# EAGLE design esp_garden (EAGLE 8.0.1)
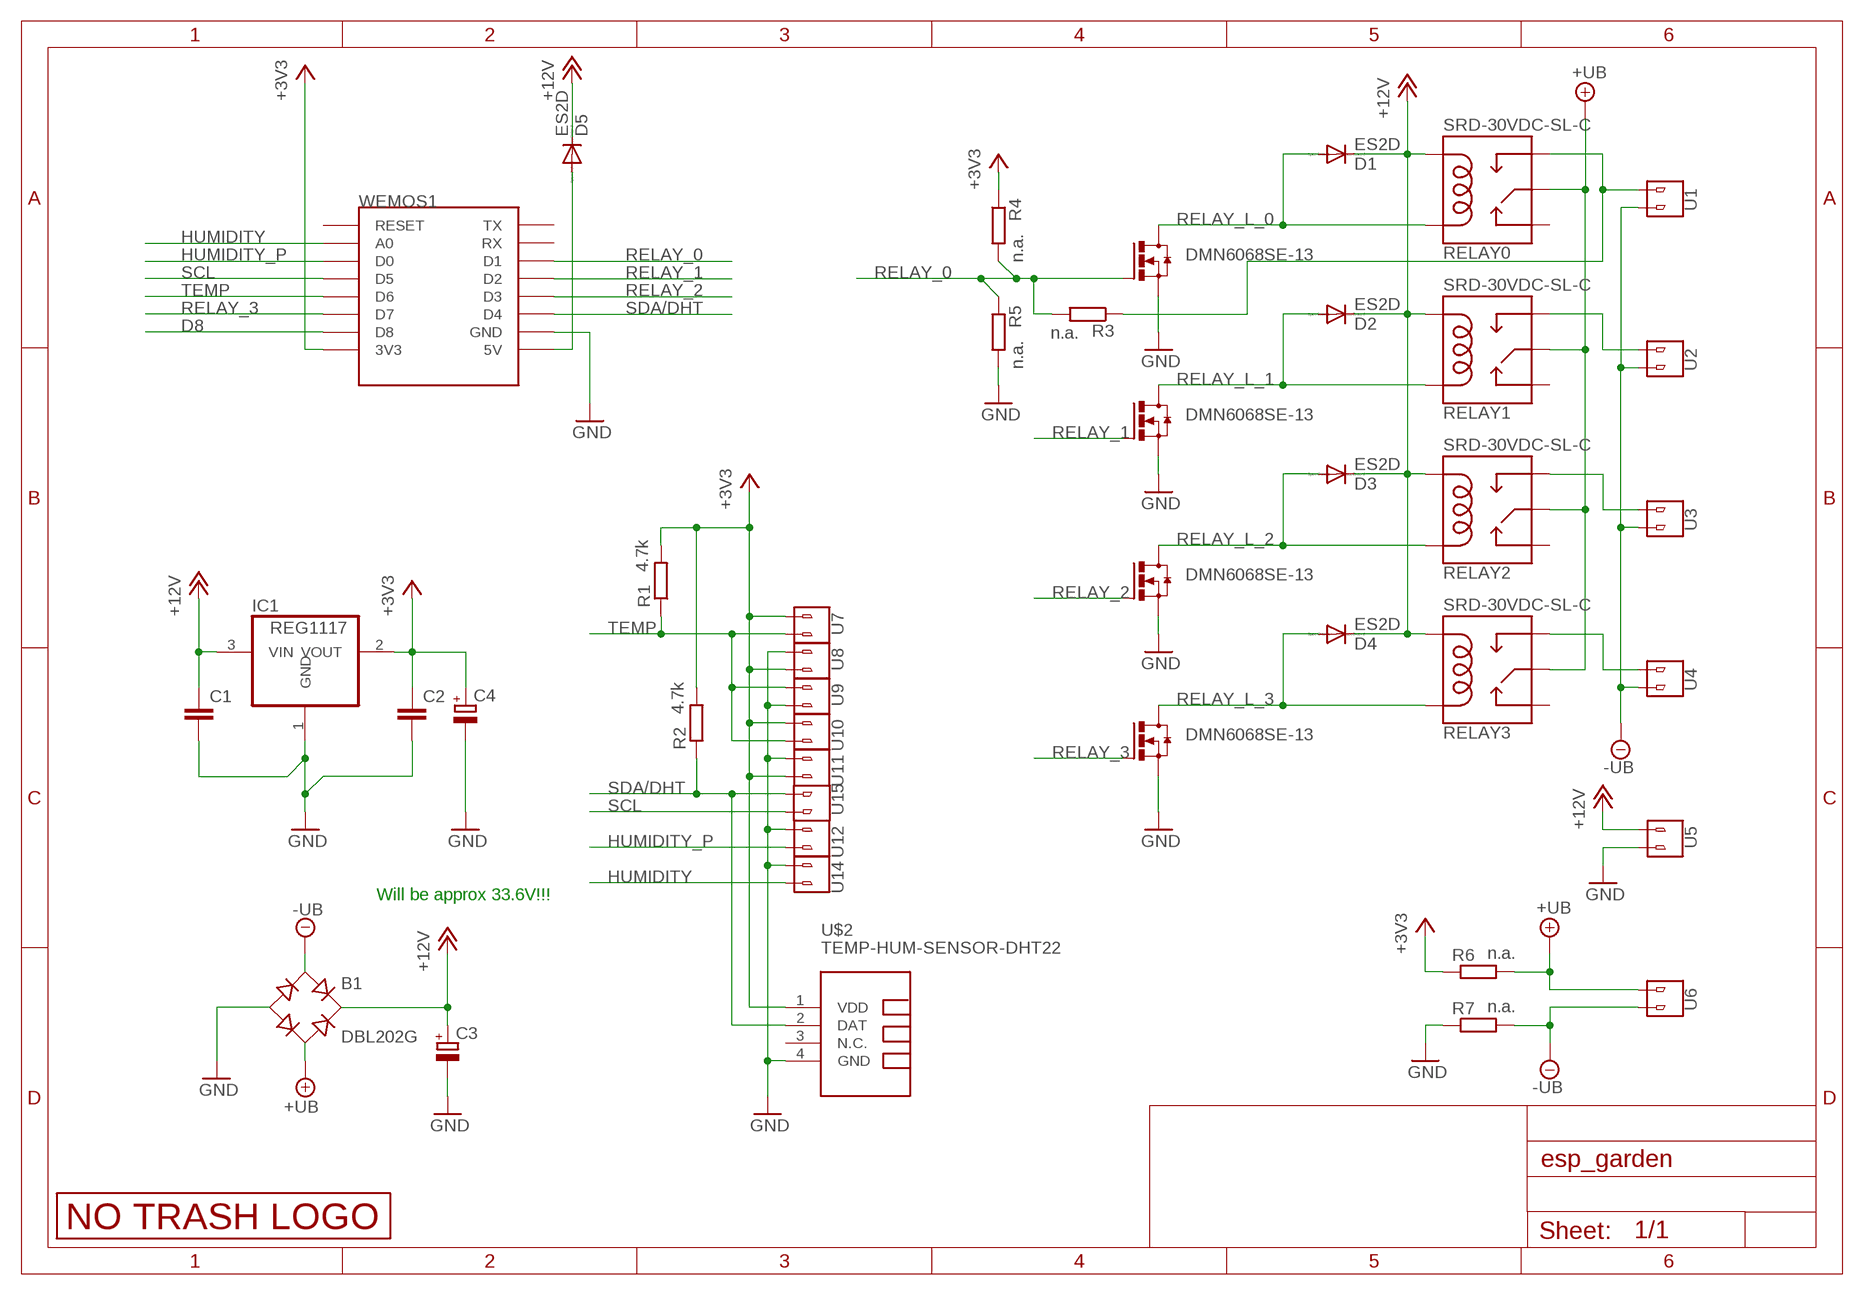
[diagram p0: schematic, sheet 1]

## Parts
B1  DBL202G  [DB]
C1  C-EUC0805  [C0805]
C2  C-EUC0805  [C0805]
C3  CPOL-EU150CLZ-0810  [150CLZ-0810]
C4  CPOL-EU150CLZ-0810  [150CLZ-0810]
D1  ES2D  DIODE-SMB  [SMB]
D2  ES2D  DIODE-SMB  [SMB]
D3  ES2D  DIODE-SMB  [SMB]
D4  ES2D  DIODE-SMB  [SMB]
D5  ES2D  DIODE-SMB  [SMB]
IC1  REG1117  [SOT223]
R1  4.7k  R-EU_M0805  [M0805]
R2  4.7k  R-EU_M0805  [M0805]
R3  n.a.  R-EU_M0805  [M0805]
R4  n.a.  R-EU_M0805  [M0805]
R5  n.a.  R-EU_M0805  [M0805]
R6  n.a.  R-EU_M0805  [M0805]
R7  n.a.  R-EU_M0805  [M0805]
RELAY0  SRD-30VDC-SL-C  RELAYPTH  [SRD-05VDC-SL-C]
RELAY1  SRD-30VDC-SL-C  RELAYPTH  [SRD-05VDC-SL-C]
RELAY2  SRD-30VDC-SL-C  RELAYPTH  [SRD-05VDC-SL-C]
RELAY3  SRD-30VDC-SL-C  RELAYPTH  [SRD-05VDC-SL-C]
T1  DMN6068SE-13  NMOSFET_SMD_223  [SOT223]
T2  DMN6068SE-13  NMOSFET_SMD_223  [SOT223]
T3  DMN6068SE-13  NMOSFET_SMD_223  [SOT223]
T4  DMN6068SE-13  NMOSFET_SMD_223  [SOT223]
U1  V1  2_PIN_CONNECTOR  [2_SCREW_PIN]
U2  V1  2_PIN_CONNECTOR  [2_SCREW_PIN]
U3  V1  2_PIN_CONNECTOR  [2_SCREW_PIN]
U4  V1  2_PIN_CONNECTOR  [2_SCREW_PIN]
U5  V1  2_PIN_CONNECTOR  [2_SCREW_PIN]
U6  V1  2_PIN_CONNECTOR  [2_SCREW_PIN]
U7  V1  2_PIN_CONNECTOR  [2_SCREW_PIN]
U8  V1  2_PIN_CONNECTOR  [2_SCREW_PIN]
U9  V1  2_PIN_CONNECTOR  [2_SCREW_PIN]
U10  V1  2_PIN_CONNECTOR  [2_SCREW_PIN]
U11  V1  2_PIN_CONNECTOR  [2_SCREW_PIN]
U12  V1  2_PIN_CONNECTOR  [2_SCREW_PIN]
U14  V1  2_PIN_CONNECTOR  [2_SCREW_PIN]
U15  V1  2_PIN_CONNECTOR  [2_SCREW_PIN]
U$1  LOGO_NO_TRASHNO_TRASH  [LOGO_ROHS_NO_TRASH]
U$2  TEMP-HUM-SENSOR-DHT22  [TEMP-HUM-SENSOR-DHT22]
WEMOS1  WEMOS-D1-MINI  [WEMOS-D1-MINI]

## Nets
+3V3: C2.1 C4.+ IC1.2(VOUT) R1.2 R2.2 R4.1 R6.1 U7.P$2 U8.P$1 U10.P$2 U11.P$1 U$2.1(VDD) WEMOS1.3V3
+12V: B1.+ C1.1 C3.+ D1.C D2.C D3.C D4.C D5.C IC1.3(VIN) RELAY0.COIL0 RELAY1.COIL0 RELAY2.COIL0 RELAY3.COIL0 U5.P$2
+UB: B1.AC2 R6.2 RELAY0.SWCOMMON RELAY1.SWCOMMON RELAY2.SWCOMMON RELAY3.SWCOMMON U6.P$1
-UB: B1.AC1 R7.2 U1.P$2 U2.P$2 U3.P$2 U4.P$2 U6.P$2
D8: WEMOS1.D8
GND: B1.- C1.2 C2.2 C3.- C4.- IC1.1(GND) R5.2 R7.1 T1.3(S) T2.3(S) T3.3(S) T4.3(S) U5.P$1 U8.P$2 U9.P$1 U11.P$2 U12.P$2 U14.P$2 U$2.4(GND) WEMOS1.GND
HUMIDITY: U14.P$1 WEMOS1.A0
HUMIDITY_P: U12.P$1 WEMOS1.D0
N$1: D5.A WEMOS1.5V
N$4: R3.1 RELAY0.SWOPEN U1.P$1
N$6: RELAY1.SWOPEN U2.P$1
N$7: RELAY2.SWOPEN U3.P$1
N$8: RELAY3.SWOPEN U4.P$1
RELAY_0: R3.2 R4.2 R5.1 T1.1(G) WEMOS1.D1
RELAY_1: T2.1(G) WEMOS1.D2
RELAY_2: T3.1(G) WEMOS1.D3
RELAY_3: T4.1(G) WEMOS1.D7
RELAY_L_0: D1.A RELAY0.COIL1 T1.2(D) T1.4(D)
RELAY_L_1: D2.A RELAY1.COIL1 T2.2(D) T2.4(D)
RELAY_L_2: D3.A RELAY2.COIL1 T3.2(D) T3.4(D)
RELAY_L_3: D4.A RELAY3.COIL1 T4.2(D) T4.4(D)
SCL: U15.P$2 WEMOS1.D5
SDA/DHT: R2.1 U15.P$1 U$2.2(DAT) WEMOS1.D4
TEMP: R1.1 U7.P$1 U9.P$2 U10.P$1 WEMOS1.D6
Unconnected: RELAY0.SWCLOSED(SWCLOSE) RELAY1.SWCLOSED(SWCLOSE) RELAY2.SWCLOSED(SWCLOSE) RELAY3.SWCLOSED(SWCLOSE) U$2.3(N.C.) WEMOS1.RESET WEMOS1.RX WEMOS1.TX

## Notes on the sheet
- Will be approx 33.6V!!!

## Library data of the parts
B1 = rectifier:DB?*G: Single Phase 1.0 AMP Glass Passivated Bridge Rectifier Taiwan Semiconductor Co.,Ltd. - TSC Source: http://www.taiwansemi.com/TSCbig5/ezcatfiles/cust/img/img/db101g.pdf http://www.ts.com.tw/db/pictures/modules/PDT/PDT060207001/DBLS201G.pdf
C1 C2 = rcl:C-EU: CAPACITOR, European symbol
C3 C4 = rcl:CPOL-EU: POLARIZED CAPACITOR, European symbol
D1-D5 = diode:DIODE-: DIODE
IC1 = burr-brown:REG1117: 800mA and 1A Low Dropout (LDO) Positive Regulator 1.8V, 2.5V, 2.85V, 3.3V, 5V, and Adj; MPN: REG1117; OC_FARNELL: 1097566; OC_NEWARK: 14P6981
R1-R7 = rcl:R-EU_: RESISTOR, European symbol
RELAY0 RELAY1-RELAY3 = JKW_CHIP:RELAY: SPDT relay (COM-00101)
T1-T4 = transistor-power:NMOSFET_SMD_223
U1-U12 U14 U15 = JKW_CHIP:2_PIN_CONNECTOR
U$1 = JKW_CHIP:LOGO_NO_TRASH
U$2 = diy-modules:TEMP-HUM-SENSOR-DHT22: DHT22 - digital humidity & temperature sensor Also known as: AM2302 AM2302 datasheet available here: http://akizukidenshi.com/download/ds/aosong/AM2302.pdf Click here to find device on ebay.com <http://www.ebay.com/sch/dht22+digital+sensor>
WEMOS1 = esp8266modules:WEMOS-D1-MINI: WeMos.cc D1 mini ESP8266 module

## Board
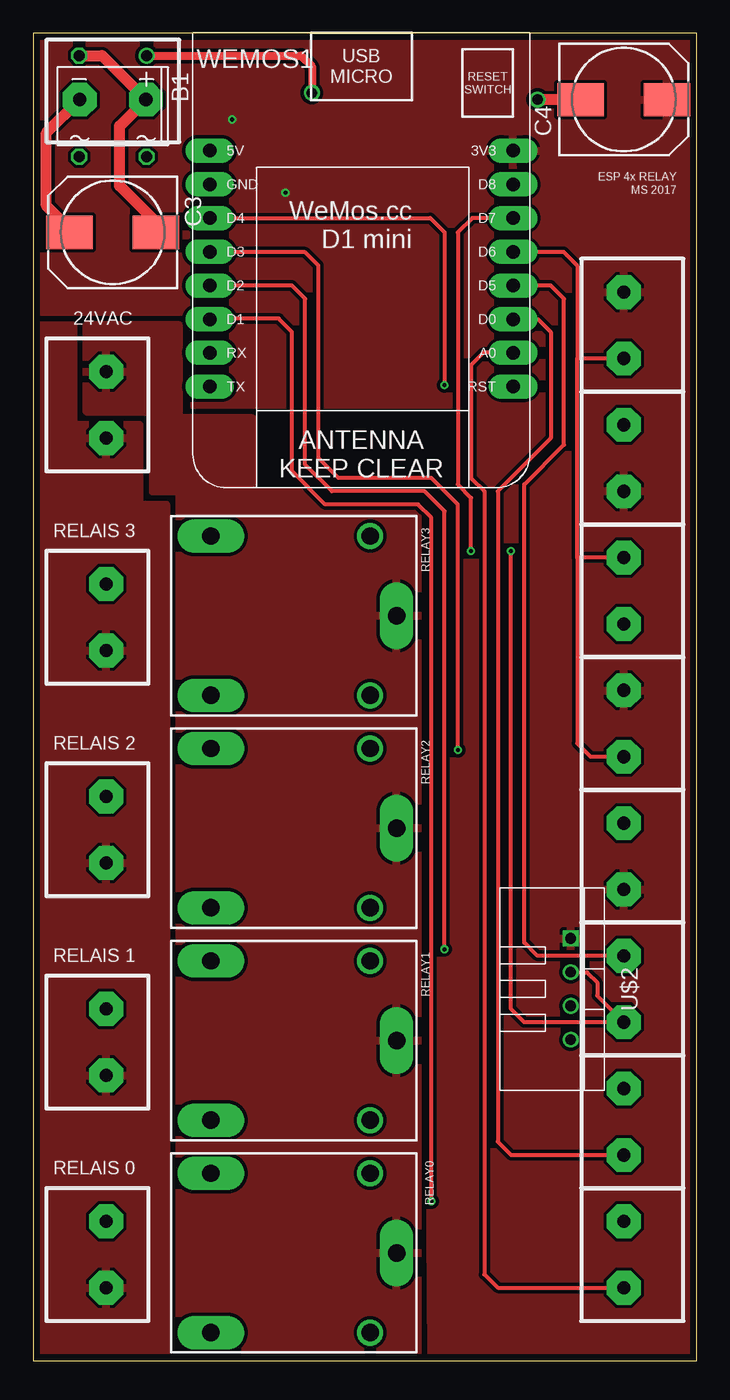
[diagram p1: board, top side]
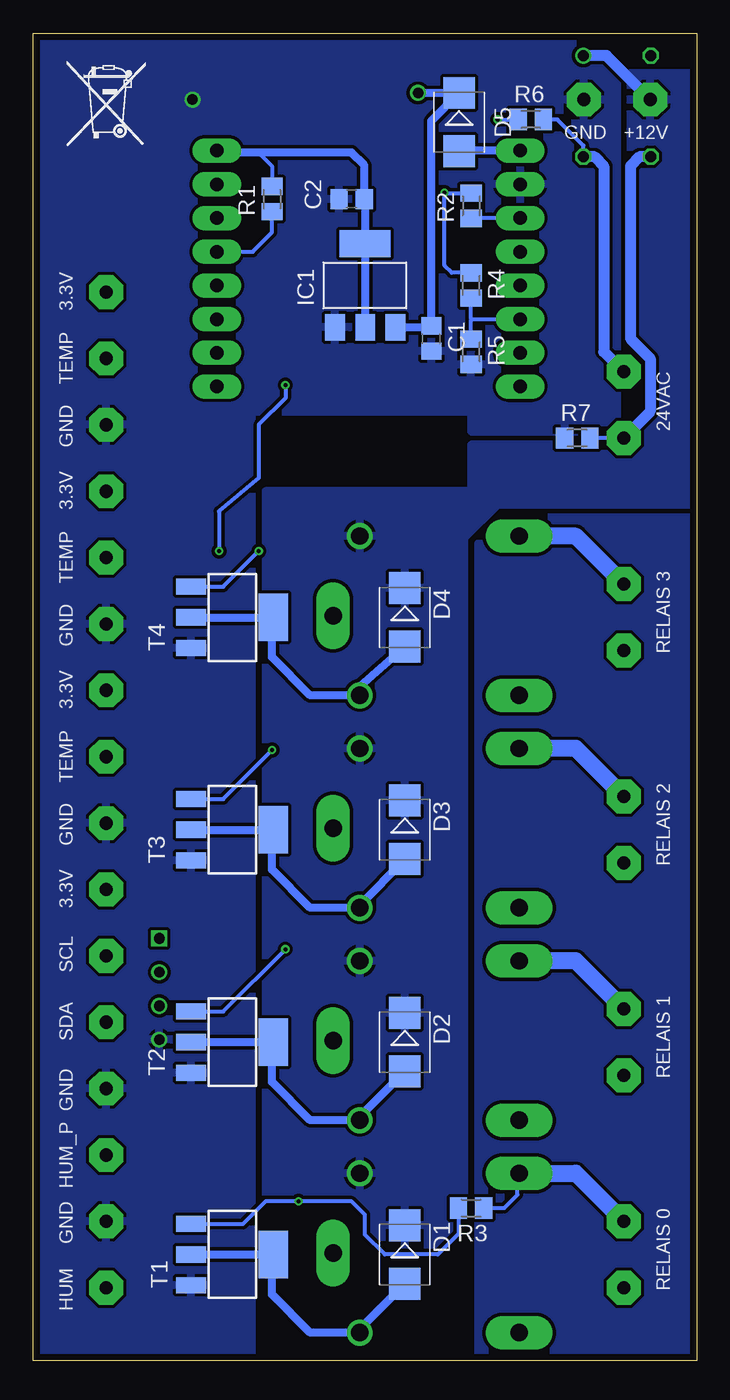
[diagram p2: board, bottom side, seen from below]

Size 50 x 100 mm. Coordinates in mm from the lower left corner, seen from the top.
Outline: 0,0 50,0 50,100 0,100 0,0
Copper layers (1*16): Top 0.035mm / dielectric 1.6mm / Bottom 0.035mm
Design rules "Elecrow_2-layer_PCB_eagle_rule": minimum track width 6mil, minimum drill 12mil, track to track 6mil, track to pad 6mil, pad to pad 6mil, via to via 8mil, smd to smd 0mil, copper to edge 20mil, drill to drill 10mil, minimum pad ring 6mil, minimum via ring 6mil, stop-mask expansion 0mil, vias tented up to drill 100mil, thermal gap 10mil

### Footprints (pad centres in the part's own frame; a part is rotated, then mirrored left to right if it is on the bottom)
DB = drill 0.813: + -2.54,-3.81 | drill 0.813 octagon: - 2.54,-3.81; AC1 2.54,3.81; AC2 -2.54,3.81
C0805 = smd 1.3 x 1.5: 1 -0.95,0; 2 0.95,0
150CLZ-0810 = smd 3.5 x 2.5: + 3.25,0; - -3.25,0
SMB = smd 2.4 x 2.4: A 2.2,0; C -2.2,0
SOT223 = smd 1.499 x 2.007: 1 -2.261,-3.15; 2 0.025,-3.15; 3 2.311,-3.15 | smd 3.81 x 2.007: 4 0,3.15
M0805 = smd 1.3 x 1.6: 1 -0.95,0; 2 0.95,0
SRD-05VDC-SL-C = drill 1.3: COIL0 -5.39,-6.12; COIL1 -5.39,5.88 | drill 1.3 pad 2.54 long: SWCLOSED 6.61,5.88; SWCOMMON -7.39,-0.12; SWOPEN 6.61,-6.12
SOT223' = smd 1.219 x 2.235: 1 -2.311,-3.099; 2 0,-3.099; 3 2.311,-3.099 | smd 3.6 x 2.2: 4 0,3.099
2_SCREW_PIN = drill 1 pad 2.54 octagon: P$1 -2.5,0.5; P$2 2.5,0.5
TEMP-HUM-SENSOR-DHT22 = drill 0.8 square: 1 -3.81,0 | drill 0.8: 2 -1.27,0; 3 1.27,0; 4 3.81,0
WEMOS-D1-MINI = drill 1.016 pad 1.829 long: 3V3 -10.16,-10.16; 5V 12.7,-10.16; A0 -10.16,5.08; D0 -10.16,2.54; D1 12.7,2.54; D2 12.7,0; D3 12.7,-2.54; D4 12.7,-5.08; D5 -10.16,0; D6 -10.16,-2.54; D7 -10.16,-5.08; D8 -10.16,-7.62; GND 12.7,-7.62; RESET -10.16,7.62; RX 12.7,5.08; TX 12.7,7.62

### Placement (x,y rotation side)
B1  6,94.5 180 top
C1  20,77 270 bottom
C2  26,87.5 180 bottom
C3  6,85 180 top
C4  44.5,95 0 top
D1  22,8 270 bottom
D2  22,24 270 bottom
D3  22,40 270 bottom
D4  22,56 270 bottom
D5  17.9,93.3 270 bottom
IC1  25,81 0 bottom
R1  32,87.5 90 bottom
R2  17,87 90 bottom
R3  17,11.5 180 bottom
R4  17,81 270 bottom
R5  17,76 270 bottom
R6  12.5,93.5 0 bottom
R7  9,69.5 0 bottom
RELAY0  20,8 180 top
RELAY1  20,24 180 top
RELAY2  20,40 180 top
RELAY3  20,56 180 top
T1  DMN6068SE-13  [SOT223']  35,8 270 bottom
T2  DMN6068SE-13  [SOT223']  35,24 270 bottom
T3  DMN6068SE-13  [SOT223']  35,40 270 bottom
T4  DMN6068SE-13  [SOT223']  35,56 270 bottom
U1  5,8 270 top
U2  5,24 270 top
U3  5,40 270 top
U4  5,56 270 top
U5  6,95.5 180 top
U6  5,72 270 top
U7  45,78 90 top
U8  45,68 90 top
U9  45,58 90 top
U10  45,48 90 top
U11  45,38 90 top
U12  45,18 90 top
U14  45,8 90 top
U15  45,28 90 top
U$1  47.5,91.5 0 bottom
U$2  40.5,28 270 top
WEMOS1  26,81 180 top

### Tracks (layer width: path | path; a pad name or v marks a point on that pad's centre or on a via)
+3V3  (via drill 0.3)
  Bottom 0.305: R1.2 32,90 33.16,91.16 WEMOS1.3V3 36.32,91 | 19,87.95 R2.2 | 19,87.95 v19,88 | R4.1 18.45,81.95 19,82.5 19,87.95 | v15,93.5 R6.1
  Bottom 0.61: IC1.2 24.98,87.42 C2.1 25.05,90.05 26,91 36,91 WEMOS1.3V3
  pour Top (isolate 0.254): 0.5,99.5 49.5,99.5 49.5,0.5 30,0.5 29.5,64.5 29.5,65 33.5,65 33.5,72 12,72 12,79 0.5,79
+12V  (via drill 0.8)
  Top 0.61: B1.+ 20.19,98.31 21,97.5 v21,95.5
  Top 0.813: C3.+ 2.75,85.25 1,87 1,92.5 U5.P$2
  Bottom 0.61: IC1.3 20.1,77.85 C1.1 20,93.4 D5.C v21,95.5
  Bottom 0.813: B1.+ 6.81,98.31 U5.P$2
  pour Bottom (isolate 0.254): 0.5,97 5,97 5,69 17,69 17,65.5 32.5,65.5 32.5,0.5 17.5,0.5 17.5,62 15,64.5 0.5,64.5
+UB
  Bottom 0.305: B1.AC2 8.54,91.54 10.5,93.5 R6.2
  Bottom 0.813: B1.AC2 7.69,90.69 7,90 7,76 U6.P$1
  pour Top (isolate 0.254): 4,71.5 9,71.5 9,65.5 11,65.5 11,0.5 29,0.5 29,65.5 16.5,65.5 16.5,71 11,71 11,78 4,78
-UB
  Bottom 0.305: U6.P$2 R7.2
  Bottom 0.813: B1.AC1 4.31,90.69 5,90 5,77 3.5,75.5 3.5,71.5 U6.P$2
  pour Top (isolate 0.254): 0.5,0.5 0.5,78 3,78 3,70.5 8,70.5 8,64.5 10,64.5 10,0.5
GND  (via drill 0.8)
  Top 0.813: B1.- 5.19,98.31 U5.P$1 6.5,93 6.5,88.5 9.25,85.75 C3.- | C4.- v38,95
  pour Bottom (isolate 0.254): 6,99.5 49.5,99.5 49.5,0.5 33.5,0.5 33.5,71.5 17,71.5 17,70 6,70
HUMIDITY
  Top 0.305: WEMOS1.A0 33.92,75.92 33,75 33,66.5 34,65.5 34,6.5 35,5.5 U14.P$1
HUMIDITY_P
  Top 0.305: WEMOS1.D0 38.04,78.46 39,77.5 39,69.5 35,65.5 35,16.5 36,15.5 U12.P$1
N$1
  Bottom 0.61: 13.36,91.1 WEMOS1.5V 17.84,91.16 D5.A
N$2
  pour Bottom (isolate 0.254): 0.5,63.5 14.5,63.5 16.5,61.5 16.5,0.5 0.5,0.5
N$4
  Bottom 0.305: R3.1 14.5,11.5 13.5,12.5 13.5,14.01 RELAY0.SWOPEN
  Bottom 1.27: U1.P$1 9.12,14.12 RELAY0.SWOPEN
N$6
  Bottom 1.27: U2.P$1 9.12,30.12 RELAY1.SWOPEN
N$7
  Bottom 1.27: U3.P$1 9.12,46.12 RELAY2.SWOPEN
N$8
  Bottom 1.27: U4.P$1 9.12,62.12 RELAY3.SWOPEN
RELAY_0  (via drill 0.3)
  Top 0.305: v30,12 30,63.5 29,64.5 22,64.5 19.5,67 19.5,77.5 18.5,78.5 13.34,78.5 WEMOS1.D1
  Bottom 0.305: T1.1 34.19,10.31 32.5,12 v30,12 26,12 25,11 25,9.5 23.5,8 19.5,8 17.95,9.55 R3.2 | 16.96,78.46 WEMOS1.D1 | 16.96,78.46 17,78.5 R4.2 | R5.1 17,78.42 16.96,78.46
RELAY_1  (via drill 0.3)
  Top 0.305: v31,31 31,64 29.5,65.5 22.5,65.5 20.5,67.5 20.5,80 19.5,81 WEMOS1.D2
  Bottom 0.305: T2.1 35.69,26.31 v31,31
RELAY_2  (via drill 0.3)
  Top 0.305: v32,46 32,64.5 30,66.5 23,66.5 21.5,68 21.5,82.5 20.5,83.5 13.34,83.5 WEMOS1.D3
  Bottom 0.305: T3.1 35.69,42.31 v32,46
RELAY_3  (via drill 0.3)
  Top 0.305: v33,61 33,65 32,66 32,85 33.08,86.08 WEMOS1.D7
  Bottom 0.305: T4.1 35.69,58.31 v33,61
RELAY_L_0
  Bottom 0.61: D1.A 25.39,2.41 RELAY0.COIL1 29.12,2.12 32,5 32,7.9 T1.4 T1.2
RELAY_L_1
  Bottom 0.61: D2.A 25.39,18.41 RELAY1.COIL1 29.12,18.12 32,21 32,23.9 T2.4 T2.2
RELAY_L_2
  Bottom 0.61: D3.A 25.39,34.31 RELAY2.COIL1 29.12,34.12 32,37 32,39.9 T3.4 T3.2
RELAY_L_3
  Bottom 0.61: D4.A 25.39,50.81 RELAY3.COIL1 29.12,50.12 32,53 32,55.9 T4.4 T4.2
SCL
  Top 0.305: U15.P$2 38,30.5 37,31.5 37,66 40,69 40,80 39,81 WEMOS1.D5
SDA/DHT  (via drill 0.3)
  Top 0.305: v36,61 36,26.5 37,25.5 U15.P$1 42.5,27.5 42.5,28.5 41.73,29.27 U$2.2 | WEMOS1.D4 29.92,86.08 31,85 v31,73.5
  Bottom 0.305: v31,73.5 31,72.5 33,70.5 33,66.5 36,64 v36,61 | WEMOS1.D4 17,86.08 R2.1
TEMP
  Top 0.305: WEMOS1.D6 39.96,83.54 41,82.5 41,75.5 | U7.P$1 41,75.5 | U10.P$1 42,45.5 41,46.5 41,60.5 | 41,60.5 41,75.5 | U9.P$2 41,60.5
  Bottom 0.305: WEMOS1.D6 33.46,83.54 32,85 R1.1

### Text on the board
tNames: ESP 4x RELAY | MS 2017 | 24VAC | RELAIS 3 | RELAIS 2 | RELAIS 1 | RELAIS 0
bNames: +12V | GND | 3.3V | TEMP | 24VAC | GND | 3.3V | TEMP | RELAIS 3 | GND | 3.3V | TEMP | RELAIS 2 | GND | 3.3V | SCL | RELAIS 1 | SDA | GND | HUM_P | RELAIS 0 | GND | HUM